# Altium schematic sheet LowCurrentIO.SchDoc
size A4
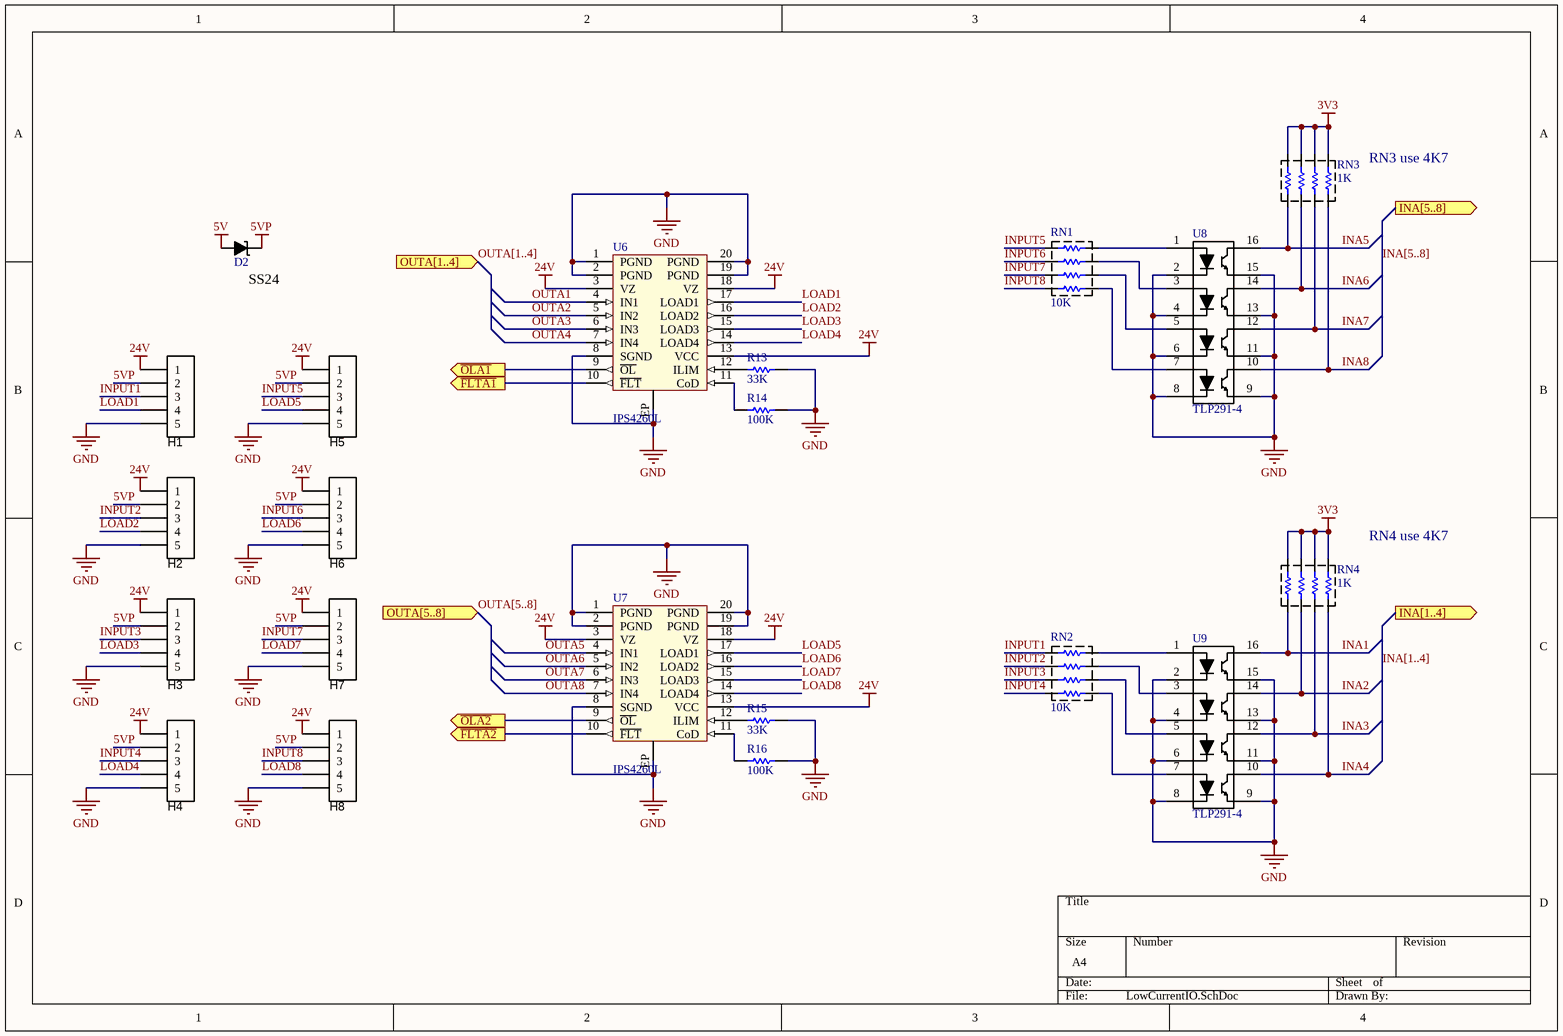
[diagram p0: LowCurrentIO.SchDoc]

## Parts
D2  MBRA210LT3G  [SMA]  (value not drawn)
H1  Programmer  [HDR_1X5_2.54MM _TE_CONC]  (value not drawn)  (no BOM)
H2  Programmer  [HDR_1X5_2.54MM _TE_CONC]  (value not drawn)  (no BOM)
H3  Programmer  [HDR_1X5_2.54MM _TE_CONC]  (value not drawn)  (no BOM)
H4  Programmer  [HDR_1X5_2.54MM _TE_CONC]  (value not drawn)  (no BOM)
H5  Programmer  [HDR_1X5_2.54MM _TE_CONC]  (value not drawn)  (no BOM)
H6  Programmer  [HDR_1X5_2.54MM _TE_CONC]  (value not drawn)  (no BOM)
H7  Programmer  [HDR_1X5_2.54MM _TE_CONC]  (value not drawn)  (no BOM)
H8  Programmer  [HDR_1X5_2.54MM _TE_CONC]  (value not drawn)  (no BOM)
R13  value 33K  [RESC1608X55N]  (hidden comment: Res1)
R14  value 100K  [RESC1608X55N]  (hidden comment: Res1)
R15  value 33K  [RESC1608X55N]  (hidden comment: Res1)
R16  value 100K  [RESC1608X55N]  (hidden comment: Res1)
RN1  value 10K  [RESCAXS50P160X320X70-8N]  (hidden comment: resistor network)
RN2  value 10K  [RESCAXS50P160X320X70-8N]  (hidden comment: resistor network)
RN3  value 1K  [RESCAXS50P160X320X70-8N]  (hidden comment: resistor network)
RN4  value 1K  [RESCAXS50P160X320X70-8N]  (hidden comment: resistor network)
U6  IPS4260L  [HTSSOP20]
U7  IPS4260L  [HTSSOP20]
U8  TLP291-4  [SOP16]
U9  TLP291-4  [SOP16]

## Ports
INA[1..4] (out), INA[5..8] (out), OUTA[1..4] (in), OUTA[5..8] (in), ~{FLTA1} (out), ~{FLTA2} (out), ~{OLA1} (out), ~{OLA2} (out)

## Nets
3V3: RN3.5 RN3.6 RN3.7 RN3.8 RN4.5 RN4.6 RN4.7 RN4.8
5V: D2.A(Anode)
5VP: D2.K(Cathode) H1.2 H2.2 H3.2 H4.2 H5.2 H6.2 H7.2 H8.2
24V: H1.1 H2.1 H3.1 H4.1 H5.1 H6.1 H7.1 H8.1 U6.3(VZ) U6.13(VCC) U6.18(VZ) U7.3(VZ) U7.13(VCC) U7.18(VZ)
GND: H1.5 H2.5 H3.5 H4.5 H5.5 H6.5 H7.5 H8.5 R13.1 R14.1 R15.1 R16.1 U6.1(PGND) U6.2(PGND) U6.8(SGND) U6.19(PGND) U6.20(PGND) U6.EP U7.1(PGND) U7.2(PGND) U7.8(SGND) U7.19(PGND) U7.20(PGND) U7.EP U8.2 U8.4 U8.6 U8.8 U8.9 U8.11 U8.13 U8.15 U9.2 U9.4 U9.6 U9.8 U9.9 U9.11 U9.13 U9.15
~{FLTA1}: U6.10(~{FLT}) ; port ~{FLTA1}
~{FLTA2}: U7.10(~{FLT}) ; port ~{FLTA2}
INA1: RN4.1 U9.16
INA2: RN4.2 U9.14
INA3: RN4.3 U9.12
INA4: RN4.4 U9.10
INA5: RN3.1 U8.16
INA6: RN3.2 U8.14
INA7: RN3.3 U8.12
INA8: RN3.4 U8.10
INPUT1: H1.3 RN2.5
INPUT2: H2.3 RN2.6
INPUT3: H3.3 RN2.7
INPUT4: H4.3 RN2.8
INPUT5: H5.3 RN1.5
INPUT6: H6.3 RN1.6
INPUT7: H7.3 RN1.7
INPUT8: H8.3 RN1.8
LOAD1: H1.4 U6.17(LOAD1)
LOAD2: H2.4 U6.16(LOAD2)
LOAD3: H3.4 U6.15(LOAD3)
LOAD4: H4.4 U6.14(LOAD4)
LOAD5: H5.4 U7.17(LOAD1)
LOAD6: H6.4 U7.16(LOAD2)
LOAD7: H7.4 U7.15(LOAD3)
LOAD8: H8.4 U7.14(LOAD4)
~{OLA1}: U6.9(~{OL}) ; port ~{OLA1}
~{OLA2}: U7.9(~{OL}) ; port ~{OLA2}
OUTA1: U6.4(IN1)
OUTA2: U6.5(IN2)
OUTA3: U6.6(IN3)
OUTA4: U6.7(IN4)
OUTA5: U7.4(IN1)
OUTA6: U7.5(IN2)
OUTA7: U7.6(IN3)
OUTA8: U7.7(IN4)
NetR13_2: R13.2 U6.12(ILIM)
NetR14_2: R14.2 U6.11(CoD)
NetR15_2: R15.2 U7.12(ILIM)
NetR16_2: R16.2 U7.11(CoD)
NetRN1_1: RN1.1 U8.7
NetRN1_2: RN1.2 U8.5
NetRN1_3: RN1.3 U8.3
NetRN1_4: RN1.4 U8.1
NetRN2_1: RN2.1 U9.7
NetRN2_2: RN2.2 U9.5
NetRN2_3: RN2.3 U9.3
NetRN2_4: RN2.4 U9.1

## Buses and harness runs
bus INA[1..4] = port INA[1..4]
bus INA[5..8] = port INA[5..8]
bus OUTA[1..4] = port OUTA[1..4]
bus OUTA[5..8] = port OUTA[5..8]

## Notes on the sheet
- (near RN3) RN3 use 4K7
- (near D2) SS24
- (near RN4) RN4 use 4K7

## Library data of the parts
D2 = MBRA210LT3G: Surface Mount  Schottky Power Rectifier; Manufacturer: ON semiconductor; Vf: 350mV; If: 2A; Vrrm: 10V; datasheet: http://www.mouser.com/ds/2/308/MBRA210LT3-D-76406.pdf
H1-H8 = Header5P: Header 5-pin
R13-R16 = Res1: Resistor; Published: 8-Jun-2000; LatestRevisionDate: 17-Jul-2002; LatestRevisionNote: Re-released for DXP Platform.; PackageReference: AXIAL-0.3; Publisher: Altium Limited; PackageDescription: Axial Device, Thru-Hole; 2 Leads; 0.3 in Pin Spacing
RN1-RN4 = RES_NET
U6 U7 = IPS4260L: IPS4260L Quad low side power switch; RDS(on)@25C: 260mR; Current per 1 ch: 0.5A; Vcc: 8-50V; RDS(on)@125C: 560mR; datasheet: https://www.mouser.hk/datasheet/2/389/ips4260l-1310053.pdf
U8 U9 = TLP291-4: Link: https://www.mouser.hk/ProductDetail/Toshiba/TLP291-4GB-TPE?qs=sGAEpiMZZMteimceiIVCB3qZhEwbmgeEa%252BDKcYuRaWM=; Parameter 1: *